# Altium schematic sheet MCU103A_Connectors.SchDoc
size 431 x 279 mm; Date: Not shown in title block; ApprovedBy: Not shown in title block; CheckedBy: Not shown in title block; Author: Not shown in title block; CompanyName: Not shown in title block; Engineer: Not shown in title block; Organization: Not shown in title block; Address1: Not shown in title block; Address2: Not shown in title block; Address3: Not shown in title block; Address4: Not shown in title block; DocumentNumber: 2; Revision: Use project parameter SCH_Rev; SheetNumber: 2; SheetTotal: 8; PageSetup: Record=PageOptions|CenterHorizontal=True|CenterVertical=True|PrintScale=1.00|XCorrection=1.00|YCorrection=1.00|PrintKind=0|BorderSize=5000000|LeftOffset=0|BottomOffset=0|Orientation=2|PaperLength=1000|PaperWidth=1000|Scale=100|PaperSource=15|PrintQuality=600|MediaType=1|DitherType=10|PaperKind=Letter|PrintScaleMode=1; CurrentTime: Not shown in title block; CurrentDate: Not shown in title block; Time: Not shown in title block; DocumentFullPathAndName: Not shown in title block; DocumentName: Not shown in title block; ModifiedDate: Not shown in title block; ImagePath: Not shown in title block
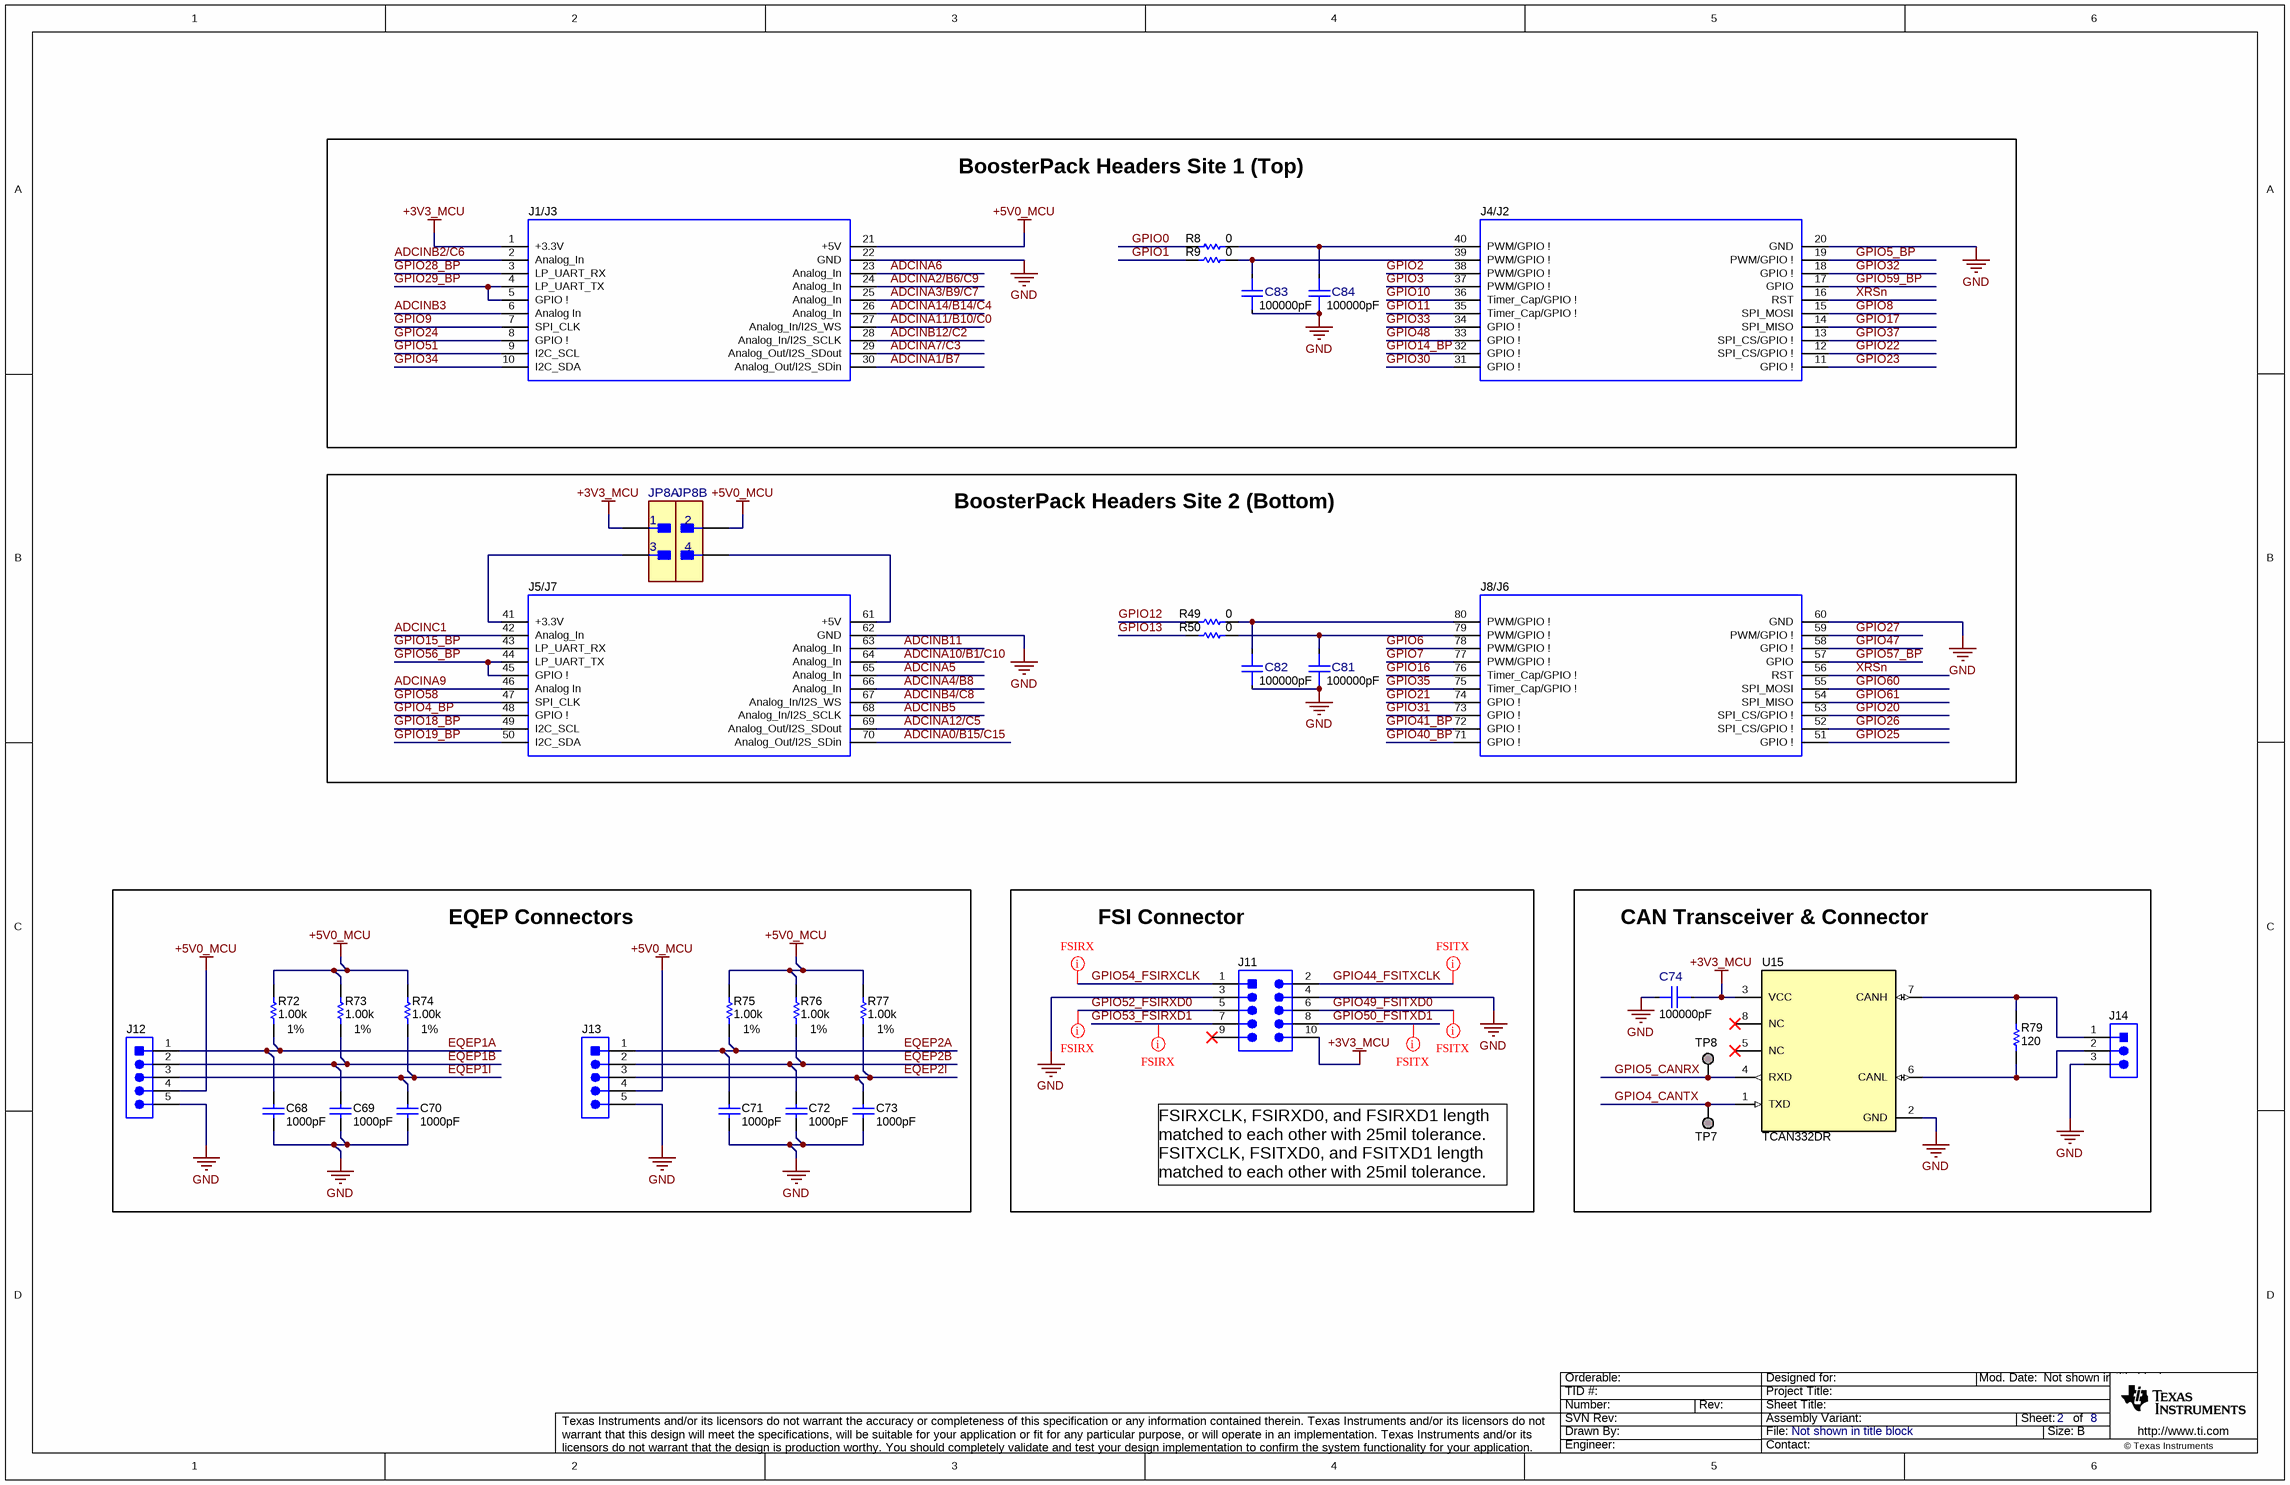
[diagram p0: MCU103A_Connectors.SchDoc]

## Parts
C68  ValueDisplayed: 1000pF  [0402]  (hidden comment: 885012205061)
C69  ValueDisplayed: 1000pF  [0402]  (hidden comment: 885012205061)
C70  ValueDisplayed: 1000pF  [0402]  (hidden comment: 885012205061)
C71  ValueDisplayed: 1000pF  [0402]  (hidden comment: 885012205061)
C72  ValueDisplayed: 1000pF  [0402]  (hidden comment: 885012205061)
C73  ValueDisplayed: 1000pF  [0402]  (hidden comment: 885012205061)
C74  ValueDisplayed: 100000pF  [FP-885012205018_0402-MFG]  (hidden comment: 885012205018)
C81  ValueDisplayed: 100000pF  [FP-885012205018_0402-MFG]  (hidden comment: 885012205018)
C82  ValueDisplayed: 100000pF  [FP-885012205018_0402-MFG]  (hidden comment: 885012205018)
C83  ValueDisplayed: 100000pF  [FP-885012205018_0402-MFG]  (hidden comment: 885012205018)
C84  ValueDisplayed: 100000pF  [FP-885012205018_0402-MFG]  (hidden comment: 885012205018)
J1/J3  SSQ-110-03-T-D  [BoosterPack_40pin_J1J3]  (value not drawn)
J4/J2  SSQ-110-03-T-D  [BoosterPack_40pin_J2J4]  (value not drawn)
J5/J7  SSQ-110-03-T-D  [BoosterPack_40pin_J5J7]  (value not drawn)
J8/J6  SSQ-110-03-T-D  [BoosterPack_40pin_J6J8]  (value not drawn)
J11  61301021121  [WURTH_61301021121]  (value not drawn)
J12  61300511121  [Wurth_61300511121]  (value not drawn)
J13  61300511121  [Wurth_61300511121]  (value not drawn)
J14  61300311121  [WURTH_61300311121]  (value not drawn)
JP8  61300421121  [FP-61300421121_HDR4-MFG]  (value not drawn)  (parts A,B of 2)
R8  ValueDisplayed: 0  [0402]  (hidden comment: RC0402JR-070RL)
R9  ValueDisplayed: 0  [0402]  (hidden comment: RC0402JR-070RL)
R49  ValueDisplayed: 0  [0402]  (hidden comment: RC0402JR-070RL)
R50  ValueDisplayed: 0  [0402]  (hidden comment: RC0402JR-070RL)
R72  ValueDisplayed: 1.00k  Value1: 1%  [0402]  (hidden comment: CRCW04021K00FKED)
R73  ValueDisplayed: 1.00k  Value1: 1%  [0402]  (hidden comment: CRCW04021K00FKED)
R74  ValueDisplayed: 1.00k  Value1: 1%  [0402]  (hidden comment: CRCW04021K00FKED)
R75  ValueDisplayed: 1.00k  Value1: 1%  [0402]  (hidden comment: CRCW04021K00FKED)
R76  ValueDisplayed: 1.00k  Value1: 1%  [0402]  (hidden comment: CRCW04021K00FKED)
R77  ValueDisplayed: 1.00k  Value1: 1%  [0402]  (hidden comment: CRCW04021K00FKED)
R79  ValueDisplayed: 120  [0603]  (hidden comment: RC0603FR-07120RL)
TP7  TESTPOINT  [TP_50MIL-25MILHOLE]  (value not drawn)  (no BOM)
TP8  TESTPOINT  [TP_50MIL-25MILHOLE]  (value not drawn)  (no BOM)
U15  TCAN332DR  [D0008A_N]

## Blocks framed on the sheet
BoosterPack Headers Site 1 (Top): C83 C84 J1/J3 J4/J2 R8 R9
BoosterPack Headers Site 2 (Bottom): C81 C82 J5/J7 J8/J6 JP8 R49 R50
EQEP Connectors: C68-C73 J12 J13 R72-R77
FSI Connector: J11
CAN Transceiver & Connector: C74 J14 R79 TP7 TP8 U15

## Nets
+3V3_MCU: C74.1 J1/J3.1(+3.3V) J11.10 JP8.1 U15.3(VCC)
+5V0_MCU: J1/J3.21(+5V) J12.4 J13.4 JP8.2 R72.2 R73.2 R74.2 R75.2 R76.2 R77.2
GND: C68.2 C69.2 C70.2 C71.2 C72.2 C73.2 C74.2 C81.1 C82.1 C83.1 C84.1 J1/J3.22(GND) J4/J2.20(GND) J5/J7.62(GND) J8/J6.60(GND) J11.3 J11.4 J12.5 J13.5 J14.3 U15.2(GND)
ADCINA0/B15/C15: J5/J7.70(Analog_Out/I2S_SDin)
ADCINA1/B7: J1/J3.30(Analog_Out/I2S_SDin)
ADCINA2/B6/C9: J1/J3.24(Analog_In)
ADCINA3/B9/C7: J1/J3.25(Analog_In)
ADCINA4/B8: J5/J7.66(Analog_In)
ADCINA5: J5/J7.65(Analog_In)
ADCINA6: J1/J3.23(Analog_In)
ADCINA7/C3: J1/J3.29(Analog_Out/I2S_SDout)
ADCINA9: J5/J7.46(Analog_In)
ADCINA10/B1/C10: J5/J7.64(Analog_In)
ADCINA11/B10/C0: J1/J3.27(Analog_In/I2S_WS)
ADCINA12/C5: J5/J7.69(Analog_Out/I2S_SDout)
ADCINA14/B14/C4: J1/J3.26(Analog_In)
ADCINB2/C6: J1/J3.2(Analog_In)
ADCINB3: J1/J3.6(Analog_In)
ADCINB4/C8: J5/J7.67(Analog_In/I2S_WS)
ADCINB5: J5/J7.68(Analog_In/I2S_SCLK)
ADCINB11: J5/J7.63(Analog_In)
ADCINB12/C2: J1/J3.28(Analog_In/I2S_SCLK)
ADCINC1: J5/J7.42(Analog_In)
EQEP1A: C68.1 J12.1 R72.1
EQEP1B: C69.1 J12.2 R73.1
EQEP1I: C70.1 J12.3 R74.1
EQEP2A: C71.1 J13.1 R75.1
EQEP2B: C72.1 J13.2 R76.1
EQEP2I: C73.1 J13.3 R77.1
GPIO0: R8.1
GPIO1: R9.1
GPIO2: J4/J2.38(PWM/GPIO_!)
GPIO3: J4/J2.37(PWM/GPIO_!)
GPIO4_BP: J5/J7.48(GPIO_!)
GPIO4_CANTX: TP7.1 U15.1(TXD)
GPIO5_BP: J4/J2.19(PWM/GPIO_!)
GPIO5_CANRX: TP8.1 U15.4(RXD)
GPIO6: J8/J6.78(PWM/GPIO_!)
GPIO7: J8/J6.77(PWM/GPIO_!)
GPIO8: J4/J2.15(SPI_MOSI)
GPIO9: J1/J3.7(SPI_CLK)
GPIO10: J4/J2.36(Timer_Cap/GPIO_!)
GPIO11: J4/J2.35(Timer_Cap/GPIO_!)
GPIO12: R49.1
GPIO13: R50.1
GPIO14_BP: J4/J2.32(GPIO_!)
GPIO15_BP: J5/J7.43(LP_UART_RX)
GPIO16: J8/J6.76(Timer_Cap/GPIO_!)
GPIO17: J4/J2.14(SPI_MISO)
GPIO18_BP: J5/J7.49(I2C_SCL)
GPIO19_BP: J5/J7.50(I2C_SDA)
GPIO20: J8/J6.53(SPI_CS/GPIO_!)
GPIO21: J8/J6.74(GPIO_!)
GPIO22: J4/J2.12(SPI_CS/GPIO_!)
GPIO23: J4/J2.11(GPIO_!)
GPIO24: J1/J3.8(GPIO_!)
GPIO25: J8/J6.51(GPIO_!)
GPIO26: J8/J6.52(SPI_CS/GPIO_!)
GPIO27: J8/J6.59(PWM/GPIO_!)
GPIO28_BP: J1/J3.3(LP_UART_RX)
GPIO29_BP: J1/J3.4(LP_UART_TX) J1/J3.5(GPIO_!)
GPIO30: J4/J2.31(GPIO_!)
GPIO31: J8/J6.73(GPIO_!)
GPIO32: J4/J2.18(GPIO_!)
GPIO33: J4/J2.34(GPIO_!)
GPIO34: J1/J3.10(I2C_SDA)
GPIO35: J8/J6.75(Timer_Cap/GPIO_!)
GPIO37: J4/J2.13(SPI_CS/GPIO_!)
GPIO40_BP: J8/J6.71(GPIO_!)
GPIO41_BP: J8/J6.72(GPIO_!)
GPIO44_FSITXCLK: J11.2
GPIO47: J8/J6.58(GPIO_!)
GPIO48: J4/J2.33(GPIO_!)
GPIO49_FSITXD0: J11.6
GPIO50_FSITXD1: J11.8
GPIO51: J1/J3.9(I2C_SCL)
GPIO52_FSIRXD0: J11.5
GPIO53_FSIRXD1: J11.7
GPIO54_FSIRXCLK: J11.1
GPIO56_BP: J5/J7.44(LP_UART_TX) J5/J7.45(GPIO_!)
GPIO57_BP: J8/J6.57(GPIO)
GPIO58: J5/J7.47(SPI_CLK)
GPIO59_BP: J4/J2.17(GPIO)
GPIO60: J8/J6.55(SPI_MOSI)
GPIO61: J8/J6.54(SPI_MISO)
XRSn: J4/J2.16(RST) J8/J6.56(RST)
NetC81_2: C81.2 J8/J6.79(PWM/GPIO_!) R50.2
NetC82_2: C82.2 J8/J6.80(PWM/GPIO_!) R49.2
NetC83_2: C83.2 J4/J2.39(PWM/GPIO_!) R9.2
NetC84_2: C84.2 J4/J2.40(PWM/GPIO_!) R8.2
NetJ5/J7_41: J5/J7.41(+3.3V) JP8.3
NetJ5/J7_61: J5/J7.61(+5V) JP8.4
NetJ14_1: J14.1 R79.2 U15.7(CANH)
NetJ14_2: J14.2 R79.1 U15.6(CANL)

Not connected (* = marked no-connect by the designer): J11 9*; U15 5(NC)* 8(NC)*

## Layout directives
net class FSIRX: GPIO52_FSIRXD0, GPIO53_FSIRXD1, GPIO54_FSIRXCLK
net class FSITX: GPIO44_FSITXCLK, GPIO49_FSITXD0, GPIO50_FSITXD1

## Notes on the sheet
- FSIRXCLK, FSIRXD0, and FSIRXD1 length matched to each other with 25mil tolerance.
  FSITXCLK, FSITXD0, and FSITXD1 length matched to each other with 25mil tolerance.
- Drawn By:
- SVN Rev:
- Number:
- TID #:
- Orderable:
- Rev:
- Sheet Title:
- File:
- Project Title:
- Designed for:
- Assembly Variant:
- Mod. Date:
- Sheet:
- Size:
- of
- B
- http://www.ti.com
- Texas Instruments and/or its licensors do not warrant the accuracy or completeness of this specification or any information contained therein. Texas Instruments and/or its licensors do not warrant that this design will meet the specifications, will be suitable for your application or fit for any particular purpose, or will operate in an implementation. Texas Instruments and/or its licensors do not warrant that the design is production worthy. You should completely validate and test your design implementation to confirm the system functionality for your application.
- Engineer:
- Contact:
- © Texas Instruments

## Library data of the parts
C68-C73 = CMP-0006231-2: CAP, CERM, 1000 pF, 50 V, +/- 10%, X7R, 0402; Manufacturer: Wurth Elektronik; Polarized: N; Value: 1000pF; U/M: EA; Cap_F: 1nF; Value1: Unknown; VDC_V: 50V; TaMin_C: -55°C; TaMax_C: 125°C; SizeArea_mm2: 0.5; SizeAreaWB_mm2: 3; SizeX_mm: 1; SizeZ_mm: 0.6; AEC Category: Q200; CompType: Capacitor; PartNumber: 885012205061; PackageReference: 0402; RoHS: Y; Tolerance_%: 10%; Value2: 50V; MountType: SMT; Technology: Ceramic; TempCo: X7R; Cap_Case: 0402; SizeY_mm: 0.5; Published: 2008-06-19; Publisher: Texas Instruments; LatestRevisionDate: 2017-03-09; ComponentLink1Description: Datasheet link; ComponentLink1URL: http://katalog.we-online.de/pbs/datasheet/885012205061.pdf; Supplier 1: Digi-Key; Supplier Part Number 1: 732-7556-1-ND; Supplier 2: Mouser; Supplier Part Number 2: 710-885012205061; AEC Qualified: N; AEC Grade: N/A
C74 C81-C84 = CMP-0090362-1: 0.1µF ±10% 10V Ceramic Capacitor X7R 0402 (1005 Metric); Manufacturer: Wurth Electronics; AEC Qualified: No; Value: 100nF; SizeZ_mm: 0.55mm; TempCo: 15%; RoHS: TRUE; Tolerance_%: 10%; datasheet: https://www.we-online.com/catalog/datasheet/885012205018.pdf; Lead Free: Yes; Operating Temperature Range: -55°C to +125°C; ComponentLink1Description: Datasheet; Digikey Description: CAP CER 0.1UF 10V X7R 0402; Supplier Part Number 1: 732-7513-1-ND; Supplier 2: Mouser; Mouser Part Number: 710-885012205018; Digikey Part Number: 732-7513-1-ND; Temperature Characteristic: X7R; Supplier 1: Digikey; Datasheet Path: datasheets/Cap-885012205018.pdf; ComponentLink1URL: https://www.we-online.com/catalog/datasheet/885012205018.pdf; VDC_V: 10V; Supplier Part Number 2: 710-885012205018; Cap_F: 100nF; PackageReference: 0402; PartNumber: 885012205018; Part Number: 885012205018; helpURL: https://upverter.com/upn/revision/1acbe355db19639d/
J1/J3 = CMP-0003837-4: Receptacle, 2.54mm, 10x2, Tin, TH; Alternate PartNumber: CRD-081413-A-G; Manufacturer: Samtec; Alternate Manufacturer: Major League Electronics; Note: Booster Pack 40 pin J1 and J3; Green_Lifecycle: Active; Green_REACh: Incomplete; Supplier 1: Digi-Key; CompType: Receptacle; PackageReference: 10x2 Receptacle; RoHS: Y; Supplier Part Number 1: SAM1204-10-ND; MountType: TH; PartNumber: SSQ-110-03-T-D; ComponentLink1Description: Datasheet Link; ComponentLink1URL: https://www.samtec.com/ftppub/cpdf/SSQ-1XX-XX-XXX-X-XX-XXX-XX-X-MKT.pdf; Supplier 2: Newark; Supplier Part Number 2: 11P8392; Green_EU RoHS: Passed; Green_EU RoHS-2: Passed
J4/J2 = CMP-0078266-4: Receptacle, 2.54mm, 10x2, Tin, TH; Alternate PartNumber: CRD-081413-A-G; Manufacturer: Samtec; Alternate Manufacturer: Major League Electronics; Note: Booster Pack 40 pin J2 and J4; Green_REACh: Incomplete; Green_Lifecycle: Active; Green_EU RoHS-2: Passed; CompType: Receptacle; Supplier 1: Digi-Key; PackageReference: 10x2 Receptacle; RoHS: Y; Supplier Part Number 1: SAM1204-10-ND; PartNumber: SSQ-110-03-T-D; MountType: TH; ComponentLink1Description: Datasheet Link; Green_EU RoHS: Passed; ComponentLink1URL: https://www.samtec.com/ftppub/cpdf/SSQ-1XX-XX-XXX-X-XX-XXX-XX-X-MKT.pdf; Supplier 2: Newark; Supplier Part Number 2: 11P8392
J5/J7 = CMP-0081070-3: Receptacle, 2.54mm, 10x2, Tin, TH; Alternate PartNumber: CRD-081413-A-G; Manufacturer: Samtec; Alternate Manufacturer: Major League Electronics; Note: Booster Pack 40 pin J5 and J7; Green_REACh: Incomplete; Green_Lifecycle: Active; ComponentLink1URL: https://www.samtec.com/ftppub/cpdf/SSQ-1XX-XX-XXX-X-XX-XXX-XX-X-MKT.pdf; Green_EU RoHS-2: Passed; CompType: Receptacle; Supplier 1: Digi-Key; PackageReference: 10x2 Receptacle; RoHS: Y; Supplier Part Number 1: SAM1204-10-ND; PartNumber: SSQ-110-03-T-D; MountType: TH; ComponentLink1Description: Datasheet Link; Green_EU RoHS: Passed
J8/J6 = CMP-0081071-3: Receptacle, 2.54mm, 10x2, Tin, TH; Alternate PartNumber: CRD-081413-A-G; Manufacturer: Samtec; Alternate Manufacturer: Major League Electronics; Note: Booster Pack 40 pin J6 and J8; Green_REACh: Incomplete; Green_Lifecycle: Active; ComponentLink1URL: https://www.samtec.com/ftppub/cpdf/SSQ-1XX-XX-XXX-X-XX-XXX-XX-X-MKT.pdf; Green_EU RoHS-2: Passed; CompType: Receptacle; Supplier 1: Digi-Key; PackageReference: 10x2 Receptacle; RoHS: Y; Supplier Part Number 1: SAM1204-10-ND; PartNumber: SSQ-110-03-T-D; MountType: TH; ComponentLink1Description: Datasheet Link; Green_EU RoHS: Passed
J11 = CMP-0054806-3: Header, 2.54 mm, 5x2, Gold, TH; Manufacturer: Wurth Elektronik; Green_Lifecycle: Active; Green_REACh: Passed; Cert_UL: Y; Current_A: 3A; Gender: Male; Pitch_mm: 2.54; Row_Count: 2; Shrouded: N; Voltage_V: 250V; ComponentLink1URL: http://katalog.we-online.de/em/datasheet/6130xx21121.pdf; ClassName: Header; Supplier Part Number 2: 16T0631; Supplier 2: Newark; Supplier Part Number 3: 710-61301021121; Supplier 3: Mouser; RoHS: Y; MountType: TH; Green_EU RoHS-2: Incomplete; Supplier 1: Digi-Key; Green_EU RoHS: Passed; PackageReference: Header, 2.54mm, 5x2, TH; CompType: Header; PartNumber: 61301021121; ComponentLink1Description: Datasheet URL; Supplier Part Number 1: 732-2672-ND; ContactFinish: Gold; Orientation: Vertical; PinCount: 10; RowSpacing_mm: 2.54
J12 J13 = CMP-0084909-1: Header, 2.54mm, 5x1, Gold, TH; Manufacturer: Wurth Elektronik; Pitch_mm: 2.54; Gender: Male; Row_Count: 1; Shrouded: N; Current_A: 3A; Voltage_V: 250V; Color: Black; PinCount: 5; ContactFinish: Gold; ComponentLink1URL: https://katalog.we-online.de/em/datasheet/6130xx11121.pdf; ComponentLink1Description: Datasheet URL; CompType: Header; MountType: TH; PartNumber: 61300511121; RoHS: Y; PackageReference: Header, 2.54mm, 5x1, TH; ClassName: Header; Orientation: Vertical
J14 = CMP-0054796-1: Header, 2.54 mm, 3x1, Gold, TH; Manufacturer: Wurth Elektronik; Green_Lifecycle: Active; Green_REACh: Passed; CNHeader: TRUE; CT: FALSE; PartNumber: 61300311121; PackageReference: Header, 2.54mm, 3x1, TH; ClassName: Header; CompType: Header; RoHS: Y; MountType: TH; ComponentLink1Description: Datasheet URL; ComponentLink1URL: http://katalog.we-online.de/em/datasheet/6130xx11121.pdf; Publisher: Texas Instruments; LatestRevisionDate: 26/05/2017; Supplier 1: Digi-Key; Supplier Part Number 1: 732-5316-ND; Supplier 2: Newark; Supplier Part Number 2: 20X0950; Supplier 3: Farnell; Supplier Part Number 3: 356154; Green_EU RoHS: Passed; Green_EU RoHS-2: Incomplete
JP8 = CMP-0092422-1: THT Vertical Pin Header WR-PHD, Pitch 2.54 mm, Dual Row, 4 pins; Manufacturer: Wurth Electronics; DUT-Pitch_mm: 2.54mm; SizeZ_mm: 8.89mm; Voltage_V: 250V; Conn Gender: Male; AEC Qualified: No; Row_Count: 2; ContactFinish: Gold; Conn Orientation: Straight; Current_A: 3A; Supplier Part Number 2: 710-61300421121; Supplier 1: Digikey; Mouser Part Number: 710-61300421121; Operating Temperature Range: -40°C to +105°C; ComponentLink1URL: https://www.we-online.com/catalog/datasheet/61300421121.pdf; Lead Free: Yes; PinCount: 4; Supplier Part Number 1: 732-5294-ND; Part Number: 61300421121; RoHS: TRUE; Digikey Part Number: 732-5294-ND; Is Female: no; Digikey Description: CONN HEADER VERT 4POS 2.54MM; datasheet: https://www.we-online.com/catalog/datasheet/61300421121.pdf; PartNumber: 61300421121; Supplier 2: Mouser; Datasheet Path: datasheets/Conn-61300421121.pdf; PackageReference: HDR4; helpURL: https://upverter.com/upn/revision/de171c811246619e/; ComponentLink1Description: Datasheet
R8 R9 R49 R50 = CMP-0027004-2: RES, 0, 5%, 0.063 W, 0402; Manufacturer: Yageo America; Power_W: 63mW; TempCo: 200 ppm/C; Value_Code: 0000; U/M: EA; Value: 0; EIA_Code: E24; SizeX_mm: 1; SizeY_mm: 0.5; SizeZ_mm: 0.6; Value2: 0.063W; VDC_V: 50V; AEC Category: Q200; Supplier Part Number 2: 603-RC0402JR-070RL; Publisher: Texas Instruments; Supplier 2: Mouser; Supplier Part Number 3: 9232516; Supplier 3: Farnell; Published: 2008-06-26; RoHS: Y; Value1: 5%; MountType: SMT; Supplier 1: Digi-Key; PackageReference: 0402; Tolerance_%: 5%; Res_ohm: 0; SizeArea_mm2: 0.5; CompType: Resistor; LatestRevisionDate: 2017-03-09; PartNumber: RC0402JR-070RL; AEC Qualified: ?; ComponentLink1Description: Datasheet link; Supplier Part Number 1: 311-0.0JRCT-ND; Technology: Thick Film; ComponentLink1URL: http://www.yageo.com/pdf/Pu-RC0402_51_PbFree_L_2.pdf
R72-R77 = CMP-0026071-3: RES, 1.00 k, 1%, 0.063 W, AEC-Q200 Grade 0, 0402; Manufacturer: Vishay-Dale; Value: 1.00k; Res_ohm: 1k; Value_Code: 1k00; Power_W: 63mW; Value2: 0.063W; VDC_V: 50V; TempCo: 100 ppm/C; SizeArea_mm2: 0.5; SizeX_mm: 1; SizeZ_mm: 0.6; EIA_Code: E96; AEC Category: Q200; AEC Qualified: Y; AEC Grade: 0; CompType: Resistor; PartNumber: CRCW04021K00FKED; PackageReference: 0402; RoHS: E; Tolerance_%: 1%; MountType: SMT; Technology: Thick Film; SizeY_mm: 0.5; ComponentLink1Description: Datasheet link; ComponentLink1URL: http://www.vishay.com/docs/20035/dcrcwe3.pdf; Supplier 1: Digi-Key; Supplier Part Number 1: 541-1.00KLCT-ND; Supplier 2: Newark; Supplier Part Number 2: 52K6545; Supplier 3: Mouser; Supplier Part Number 3: 71-CRCW0402-1.0K-E3
R79 = CMP-0022769-3: RES, 120, 1%, 0.1 W, 0603; Manufacturer: Yageo America; Value: 120; Value_Code: 120R; Power_W: 100mW; Value2: 0.1W; VDC_V: 150V; TempCo: 200 ppm/C; SizeArea_mm2: 1.28; SizeX_mm: 1.6; SizeY_mm: 0.8; SizeZ_mm: 1; U/M: EA; AEC Category: Q200; CompType: Resistor; PartNumber: RC0603FR-07120RL; PackageReference: 0603; RoHS: Y; Res_ohm: 120; Tolerance_%: 1%; Value1: 1%; MountType: SMT; Technology: Thick Film; Published: 2008-06-26; Publisher: Texas Instruments; LatestRevisionDate: 2017-03-09; ComponentLink1Description: Datasheet link; ComponentLink1URL: http://www.yageo.com/pdf/Pu-RC0603_51_PbFree_L_2.pdf; Supplier 1: Digi-Key; Supplier Part Number 1: 311-120HRCT-ND; Supplier 2: Mouser; Supplier Part Number 2: 603-RC0603FR-07120RL; Supplier 3: Farnell; Supplier Part Number 3: 9238379; AEC Qualified: ?
TP7 TP8 = CMP-0078143-3: TEST POINT.  No entry in BOM.; CompType: Testpoint; PackageReference: N/A; Manufacturer: N/A; PartNumber: N/A; Library Reference: TESTPOINT
U15 = CMP-0080974-2: 3.3-V CAN Transceivers, D0008A (SOIC-8); Alternate Manufacturer: Texas Instruments; SizeAreaWB_mm2: 56.58; SizeZ_mm: 1.75; SizeX_mm: 4.9; SizeY_mm: 6.2; SizeArea_mm2: 30.38; CompType: IC; AEC Qualified: N; AEC Category: Q200; ComponentLink1URL: http://www.ti.com/lit/ds/symlink/tcan332.pdf; Alternate PartNumber: TCAN332D; PackageDescription: SOIC-8; RoHS: Y; MountType: SMT; ComponentLink2URL: http://www.ti.com/product/tcan332; ComponentLink3Description: Online Datasheet; ComponentLink2Description: Product Folder; Manufacturer: Texas Instruments; ComponentLink3URL: http://www.ti.com/product/tcan332/datasheet; PackageReference: D0008A; PartNumber: TCAN332DR; ComponentLink1Description: Datasheet Link